# Altium schematic sheet RS232.SchDoc: Bernardo
size A3; Date: 14/11/2018; DrawnBy: Wim Van Gool; Revision: 01; SheetNumber: 6; SheetTotal: 7
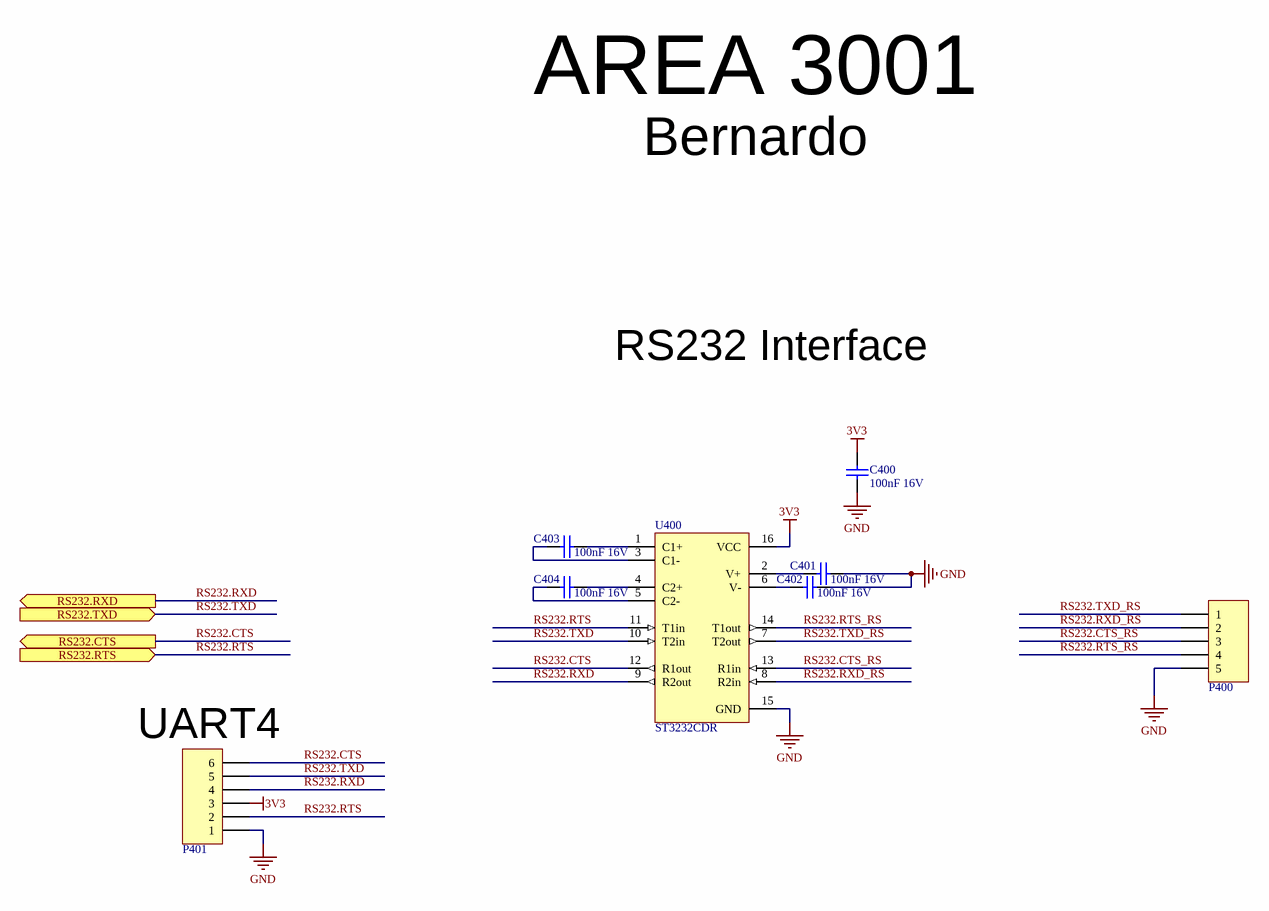
[diagram p0: RS232.SchDoc]

## Parts
C400  value 100nF 16V  [C0603_N]  (hidden comment: CAP_CERAMIC)
C401  value 100nF 16V  [C0603_N]  (hidden comment: CAP_CERAMIC)
C402  value 100nF 16V  [C0603_N]  (hidden comment: CAP_CERAMIC)
C403  value 100nF 16V  [C0603_N]  (hidden comment: CAP_CERAMIC)
C404  value 100nF 16V  [C0603_N]  (hidden comment: CAP_CERAMIC)
P400  5 Terminal Socket 2,5mm  [WE_691382000005]  (value not drawn)
P401  Header 6  [HDR1X6]  (value not drawn)
U400  value ST3232CDR  [SOIC_N_16]  (hidden comment: RS-232 3V3 Transceiver SOIC)

## Ports
RS232.CTS (out), RS232.RTS (in), RS232.RXD (out), RS232.TXD (in)

## Nets
3V3: C400.1 P401.3 U400.16(VCC)
GND: C400.2 C401.2 C402.2 P400.5 P401.1 U400.15(GND)
RS232.CTS: P401.6 U400.12(R1out) ; port RS232.CTS
RS232.CTS_RS: P400.3 U400.13(R1in)
RS232.RTS: P401.2 U400.11(T1in) ; port RS232.RTS
RS232.RTS_RS: P400.4 U400.14(T1out)
RS232.RXD: P401.4 U400.9(R2out) ; port RS232.RXD
RS232.RXD_RS: P400.2 U400.8(R2in)
RS232.TXD: P401.5 U400.10(T2in) ; port RS232.TXD
RS232.TXD_RS: P400.1 U400.7(T2out)
NetC401_1: C401.1 U400.2(V+)
NetC402_1: C402.1 U400.6(V-)
NetC403_1: C403.1 U400.3(C1-)
NetC403_2: C403.2 U400.1(C1+)
NetC404_1: C404.1 U400.5(C2-)
NetC404_2: C404.2 U400.4(C2+)

## Notes on the sheet
- AREA 3001
- Bernardo
- RS232 Interface
- (near P401) UART4
- Title
- Revision
- Date
- Dranw By
- Size
- A3
- Sheet
- of

## Library data of the parts
C400-C404 = CAP # 100nF 16V 0603: Capacitor Ceramic
P400 = Terminal Block Socket 2,5mm 5way - 691382000005: Value: 691382000005; Supplier 1: Wurth; Supplier Part Number 1: 691382000005
P401 = Pin Header 2.54mm 6way
U400 = ST3232CDR # RS-232 3V3 Transceiver: =Description; Supplier 1: Farnell; Supplier Part Number 1: 2463693